# Altium schematic sheet Isolated UART-USB.SchDoc
size A4
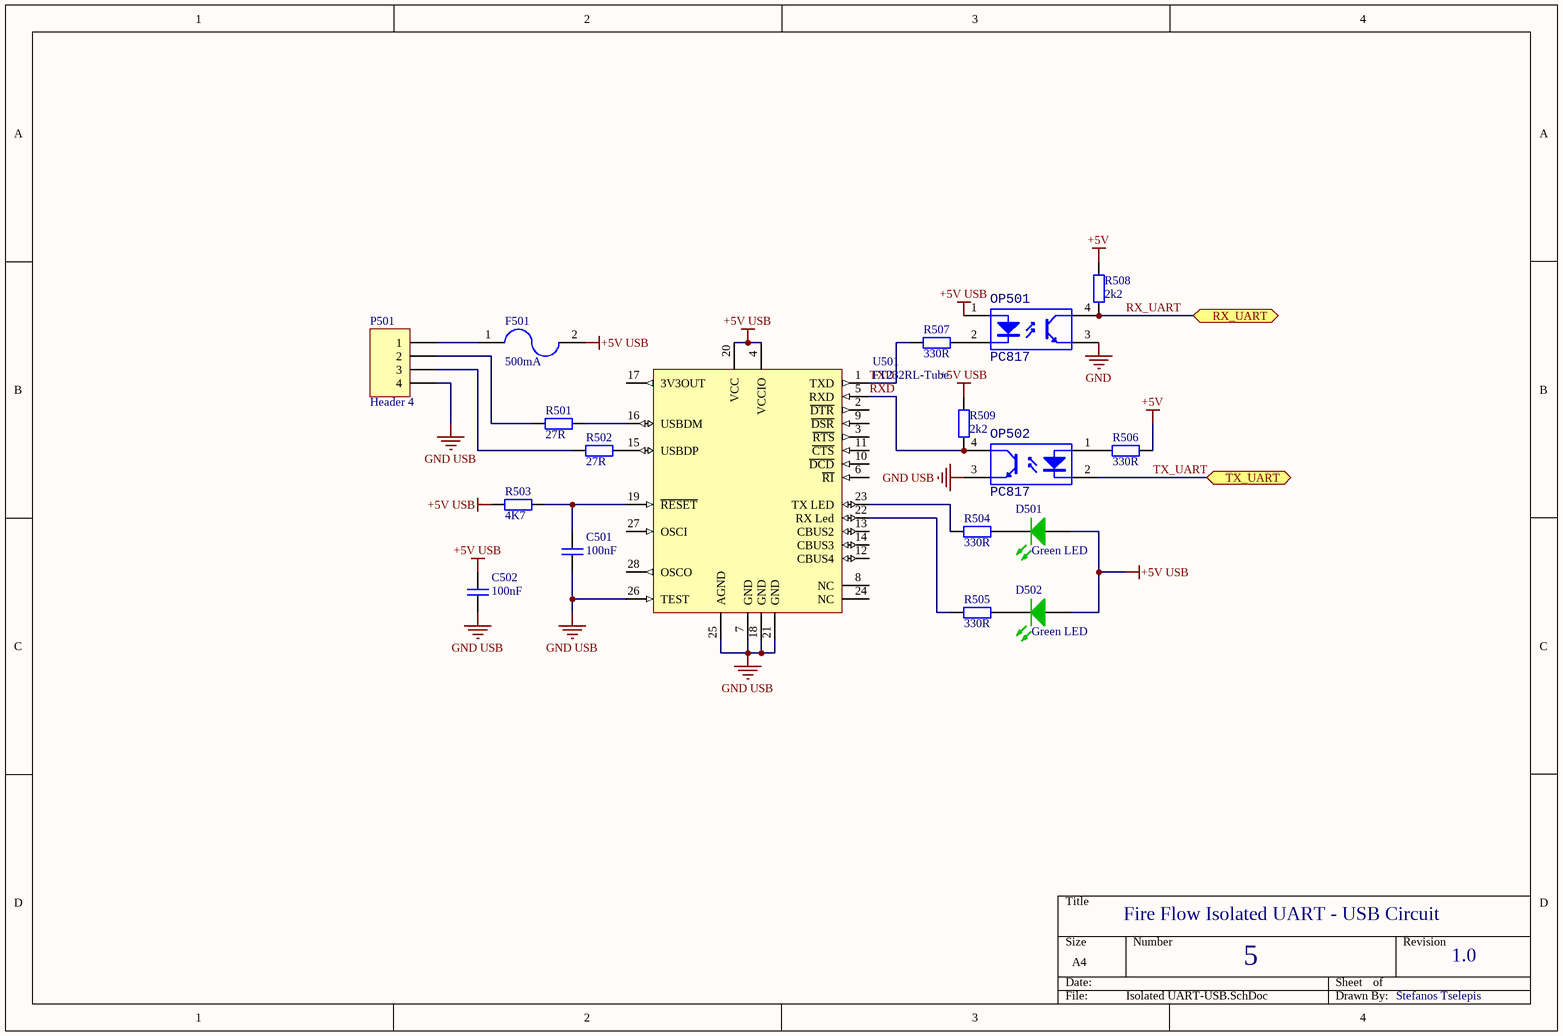
[diagram p0: Isolated UART-USB.SchDoc]

## Parts
C501  100nF  [CC2013-0805]
C502  100nF  [CC2013-0805]
D501  Green LED  [CD3216-1206]
D502  Green LED  [CD3216-1206]
F501  500mA  [CF-1812]
OP501  PC817  [DIP-4]
OP502  PC817  [DIP-4]
P501  Header 4  [HDR1X4]
R501  27R  [CR2012-0805]
R502  27R  [CR2012-0805]
R503  4K7  [CR2012-0805]
R504  330R  [CR2012-0805]
R505  330R  [CR2012-0805]
R506  330R  [CR2012-0805]
R507  330R  [CR2012-0805]
R508  2k2  [CR2012-0805]
R509  2k2  [CR2012-0805]
U501  FT232RL-Tube  [SSOP-28_N]

## Ports
RX_UART, TX_UART

## Nets
+5V: R506.2 R508.2
+5V USB: C502.1 D501.1(A) D502.1(A) F501.2 OP501.1(A) R503.1 R509.2 U501.4(VCCIO) U501.20(VCC)
GND: OP501.3(E)
GND USB: C501.2 C502.2 OP502.3(E) P501.4 U501.7(GND) U501.18(GND) U501.21(GND) U501.25(AGND) U501.26(TEST)
RX_UART: OP501.4(C) R508.1 ; port RX_UART
RXD: OP502.4(C) R509.1 U501.5(RXD)
TX_UART: OP502.2(K) ; port TX_UART
TXD: R507.1 U501.1(TXD)
NetC501_1: C501.1 R503.2 U501.19(~{RESET})
NetD501_2: D501.2(K) R504.2
NetD502_2: D502.2(K) R505.2
NetF501_1: F501.1 P501.1
NetOP501_2: OP501.2(K) R507.2
NetOP502_1: OP502.1(A) R506.1
NetP501_2: P501.2 R501.2
NetP501_3: P501.3 R502.2
NetR501_1: R501.1 U501.16(USBDM)
NetR502_1: R502.1 U501.15(USBDP)
NetR504_1: R504.1 U501.23(TX_LED)
NetR505_1: R505.1 U501.22(RX_Led)

Not connected (* = marked no-connect by the designer): U501 2(~{DTR}) 3(~{RTS}) 6(~{RI}) 8(NC) 9(~{DSR}) 10(~{DCD}) 11(~{CTS}) 12(CBUS4) 13(CBUS2) 14(CBUS3) 17(3V3OUT) 24(NC) 27(OSCI) 28(OSCO)

## Notes on the sheet
- Fire Flow Isolated UART - USB Circuit
- 5
- 1.0
- Stefanos Tselepis

## Library data of the parts
C501 C502 = Cap Metal Film: Value: 100nF
D501 D502 = LED: RED
F501 = Fuse: PPTC; Value: 500mA
OP501 OP502 = OPTO-DC: DC OPTOCUPLER
P501 = Header 4: Header, 4-Pin; LatestRevisionDate: 17-Jul-2002; LatestRevisionNote: Re-released for DXP Platform.; Publisher: Altium Limited
R501-R509 = Resistor
  R501 R502: Value: 27R
  R503: Value: 4K7
  R504-R507: Value: 330R
  R508 R509: Value: 2k2
U501 = FT232RL-Tube: USB UART Asynchronous Serial Data Transfer Chip, SSOP-28, Tube; PackageReference: SSOP-28; PackageDescription: 28-Pin Small Outline Package 0.65 mm Pitch